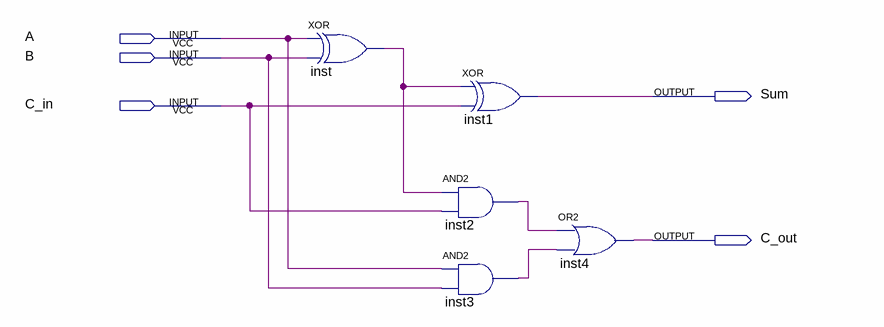
[diagram p0: schematic sheet]
// Quartus schematic full_adder.bdf as structural Verilog: 5 symbols, 5 pins
module full_adder (
  input  A,
  input  B,
  input  C_in,
  output Sum,
  output C_out
);

  wire inst2_out, inst3_out, inst_out;

  xor inst (inst_out, A, B);
  and inst2 (inst2_out, inst_out, C_in);
  and inst3 (inst3_out, A, B);
  xor inst1 (Sum, inst_out, C_in);
  or inst4 (C_out, inst2_out, inst3_out);
endmodule
